# Altium schematic sheet PowerSupply.SchDoc
size B; SheetNumber: 7; SheetTotal: 8
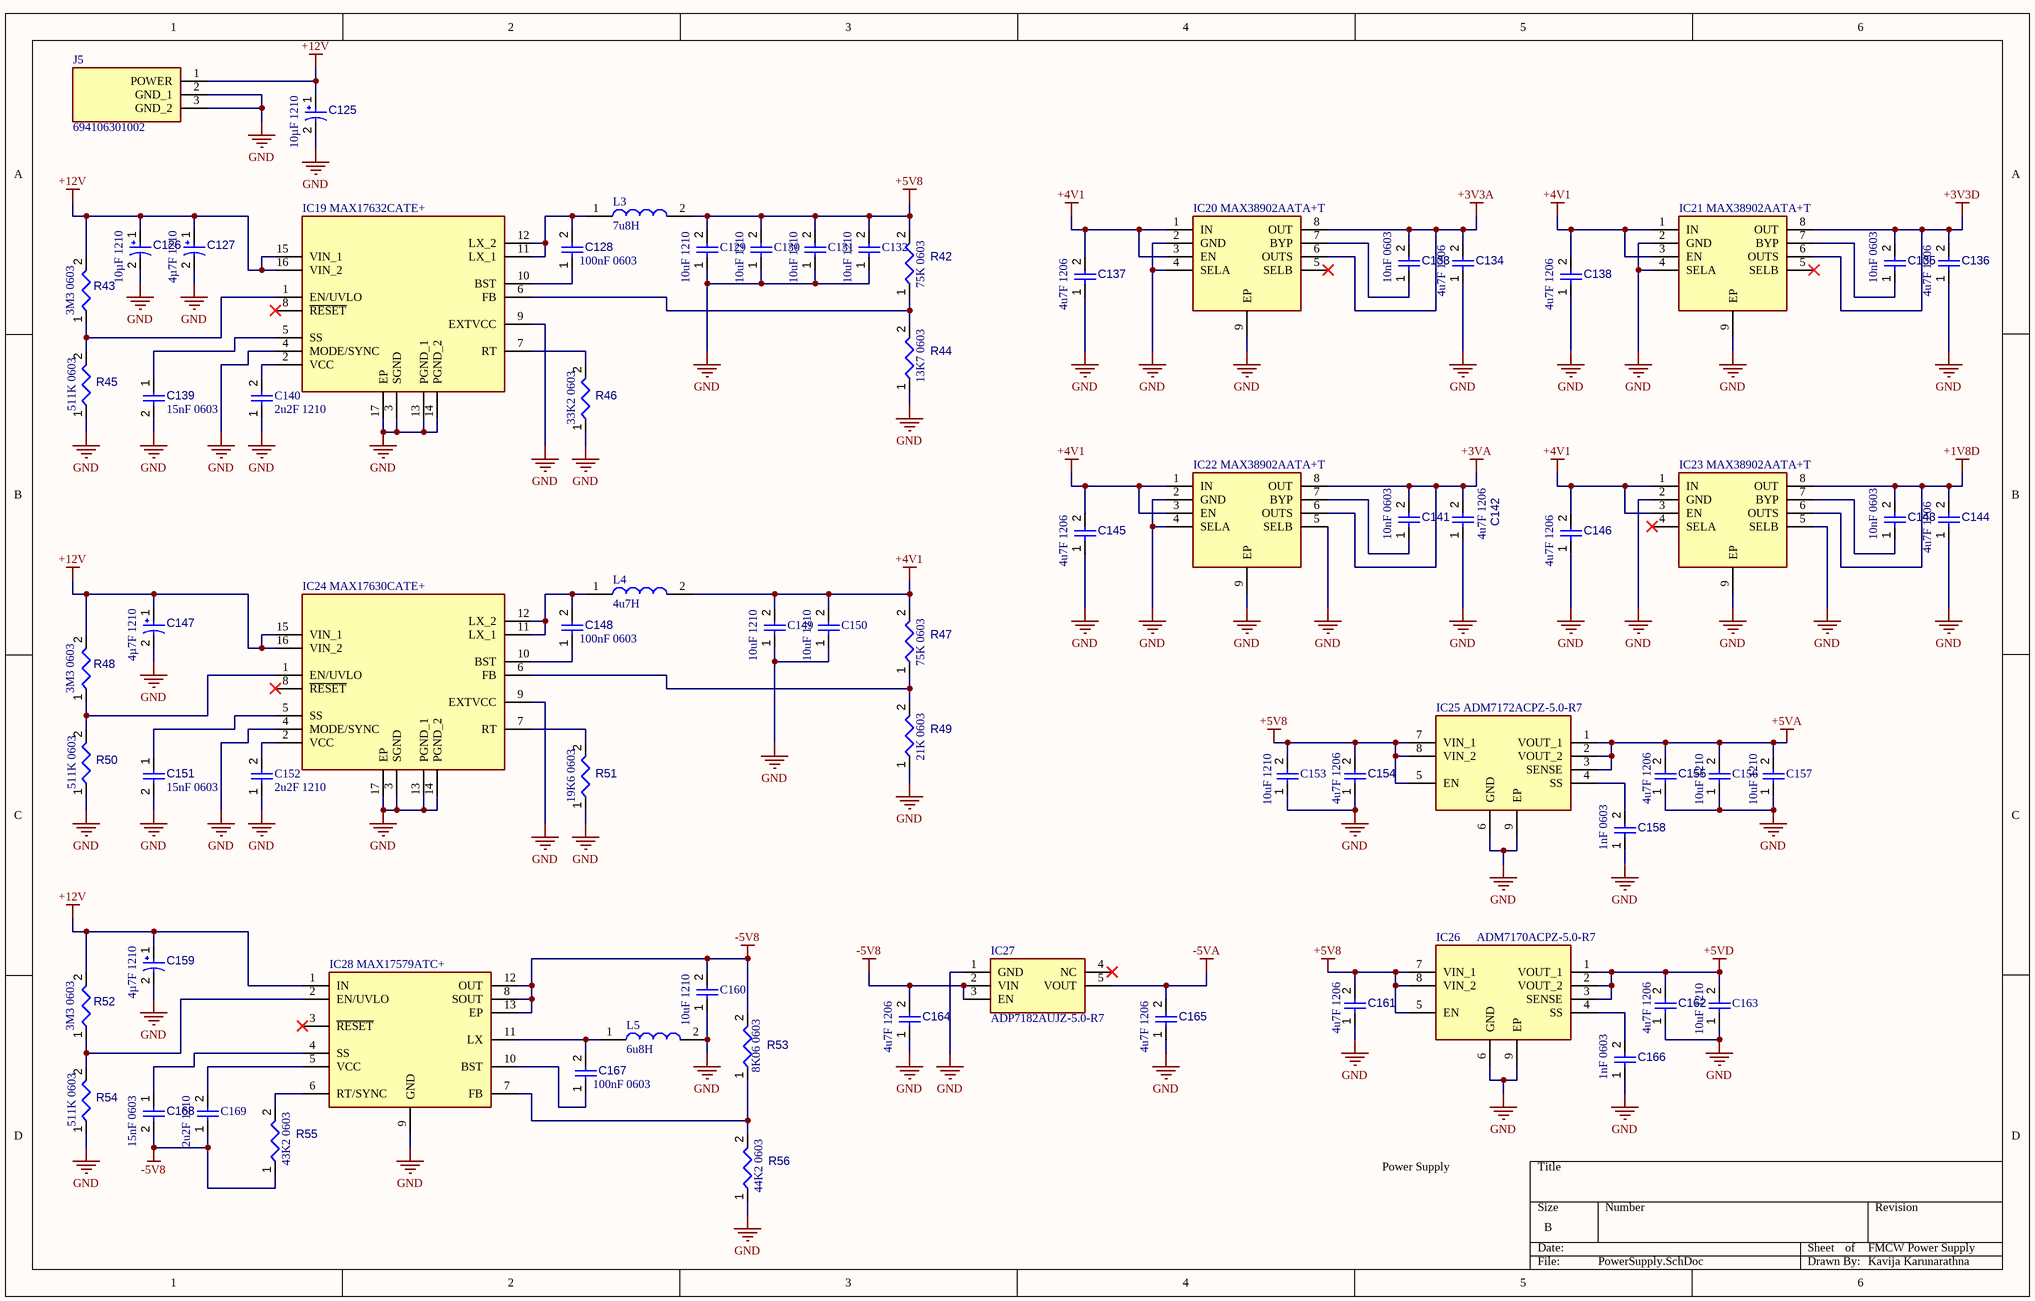
[diagram p0: PowerSupply.SchDoc]

## Parts
C125  value 10µF 1210  [AVX-TAJ-B-2_N]  (hidden comment: TAJB106K016RNJ)
C126  value 10µF 1210  [AVX-TAJ-B-2_N]  (hidden comment: TAJB106K016RNJ)
C127  value 4µ7F 1210  [AVX-TAJ-B-2_N]  (hidden comment: TAJB106K016RNJ)
C128  value 100nF 0603  [CAPC0603(1608)100_L]  (hidden comment: Capacitor 1µF +/-0.1% 25V 0603)
C129  10uF 1210  [CAPC3225X279N]
C130  10uF 1210  [CAPC3225X279N]
C131  10uF 1210  [CAPC3225X279N]
C132  10uF 1210  [CAPC3225X279N]
C133  value 10nF 0603  [CAPC0603(1608)100_L]  (hidden comment: Capacitor 1µF +/-0.1% 25V 0603)
C134  value 4u7F 1206  [CAPC3216X180X50NL20T25]  (hidden comment: Capacitor 10 uF +/- 10% 16 V 1206)
C135  value 10nF 0603  [CAPC0603(1608)100_L]  (hidden comment: Capacitor 1µF +/-0.1% 25V 0603)
C136  value 4u7F 1206  [CAPC3216X180X50NL20T25]  (hidden comment: Capacitor 10 uF +/- 10% 16 V 1206)
C137  value 4u7F 1206  [CAPC3216X180X50NL20T25]  (hidden comment: Capacitor 10 uF +/- 10% 16 V 1206)
C138  value 4u7F 1206  [CAPC3216X180X50NL20T25]  (hidden comment: Capacitor 10 uF +/- 10% 16 V 1206)
C139  value 15nF 0603  [CAPC0603(1608)100_L]  (hidden comment: Capacitor 1µF +/-0.1% 25V 0603)
C140  2u2F 1210  [CAPC3225X279N]
C141  value 10nF 0603  [CAPC0603(1608)100_L]  (hidden comment: Capacitor 1µF +/-0.1% 25V 0603)
C142  value 4u7F 1206  [CAPC3216X180X50NL20T25]  (hidden comment: Capacitor 10 uF +/- 10% 16 V 1206)
C143  value 10nF 0603  [CAPC0603(1608)100_L]  (hidden comment: Capacitor 1µF +/-0.1% 25V 0603)
C144  value 4u7F 1206  [CAPC3216X180X50NL20T25]  (hidden comment: Capacitor 10 uF +/- 10% 16 V 1206)
C145  value 4u7F 1206  [CAPC3216X180X50NL20T25]  (hidden comment: Capacitor 10 uF +/- 10% 16 V 1206)
C146  value 4u7F 1206  [CAPC3216X180X50NL20T25]  (hidden comment: Capacitor 10 uF +/- 10% 16 V 1206)
C147  value 4µ7F 1210  [AVX-TAJ-B-2_N]  (hidden comment: TAJB106K016RNJ)
C148  value 100nF 0603  [CAPC0603(1608)100_L]  (hidden comment: Capacitor 1µF +/-0.1% 25V 0603)
C149  10uF 1210  [CAPC3225X279N]
C150  10uF 1210  [CAPC3225X279N]
C151  value 15nF 0603  [CAPC0603(1608)100_L]  (hidden comment: Capacitor 1µF +/-0.1% 25V 0603)
C152  2u2F 1210  [CAPC3225X279N]
C153  10uF 1210  [CAPC3225X279N]
C154  value 4u7F 1206  [CAPC3216X180X50NL20T25]  (hidden comment: Capacitor 10 uF +/- 10% 16 V 1206)
C155  value 4u7F 1206  [CAPC3216X180X50NL20T25]  (hidden comment: Capacitor 10 uF +/- 10% 16 V 1206)
C156  10uF 1210  [CAPC3225X279N]
C157  10uF 1210  [CAPC3225X279N]
C158  value 1nF 0603  [CAPC0603(1608)100_L]  (hidden comment: Capacitor 1µF +/-0.1% 25V 0603)
C159  value 4µ7F 1210  [AVX-TAJ-B-2_N]  (hidden comment: TAJB106K016RNJ)
C160  10uF 1210  [CAPC3225X279N]
C161  value 4u7F 1206  [CAPC3216X180X50NL20T25]  (hidden comment: Capacitor 10 uF +/- 10% 16 V 1206)
C162  value 4u7F 1206  [CAPC3216X180X50NL20T25]  (hidden comment: Capacitor 10 uF +/- 10% 16 V 1206)
C163  10uF 1210  [CAPC3225X279N]
C164  value 4u7F 1206  [CAPC3216X180X50NL20T25]  (hidden comment: Capacitor 10 uF +/- 10% 16 V 1206)
C165  value 4u7F 1206  [CAPC3216X180X50NL20T25]  (hidden comment: Capacitor 10 uF +/- 10% 16 V 1206)
C166  value 1nF 0603  [CAPC0603(1608)100_L]  (hidden comment: Capacitor 1µF +/-0.1% 25V 0603)
C167  value 100nF 0603  [CAPC0603(1608)100_L]  (hidden comment: Capacitor 1µF +/-0.1% 25V 0603)
C168  value 15nF 0603  [CAPC0603(1608)100_L]  (hidden comment: Capacitor 1µF +/-0.1% 25V 0603)
C169  2u2F 1210  [CAPC3225X279N]
IC19  MAX17632CATE+  [QFN50P300X300X80-17N]
IC20  MAX38902AATA+T  [SON50P200X200X80-9N-D]
IC21  MAX38902AATA+T  [SON50P200X200X80-9N-D]
IC22  MAX38902AATA+T  [SON50P200X200X80-9N-D]
IC23  MAX38902AATA+T  [SON50P200X200X80-9N-D]
IC24  MAX17630CATE+  [QFN50P300X300X80-17N]
IC25  ADM7172ACPZ-5.0-R7  [SON50P300X300X80-9N-D]
IC26  ADM7170ACPZ-5.0-R7  [SON50P300X300X80-9N-D]
IC27  ADP7182AUJZ-5.0-R7  [SOT95P280X100-5N]
IC28  MAX17579ATC+  [SON50P300X300X80-13N]
J5  694106301002  [694106301002]
L3  7u8H  [INDPM135129X640N]
L4  4u7H  [INDPM135129X640N]
L5  6u8H  [SPM7054VC6R8MD]
R42  value 75K 0603  [RESC0603(1608)_L]  (hidden comment: 120R3J)
R43  value 3M3 0603  [RESC0603(1608)_L]  (hidden comment: 120R3J)
R44  value 13K7 0603  [RESC0603(1608)_L]  (hidden comment: 120R3J)
R45  value 511K 0603  [RESC0603(1608)_L]  (hidden comment: 120R3J)
R46  value 33K2 0603  [RESC0603(1608)_L]  (hidden comment: 120R3J)
R47  value 75K 0603  [RESC0603(1608)_L]  (hidden comment: 120R3J)
R48  value 3M3 0603  [RESC0603(1608)_L]  (hidden comment: 120R3J)
R49  value 21K 0603  [RESC0603(1608)_L]  (hidden comment: 120R3J)
R50  value 511K 0603  [RESC0603(1608)_L]  (hidden comment: 120R3J)
R51  value 19K6 0603  [RESC0603(1608)_L]  (hidden comment: 120R3J)
R52  value 3M3 0603  [RESC0603(1608)_L]  (hidden comment: 120R3J)
R53  value 8K06 0603  [RESC0603(1608)_L]  (hidden comment: 120R3J)
R54  value 511K 0603  [RESC0603(1608)_L]  (hidden comment: 120R3J)
R55  value 43K2 0603  [RESC0603(1608)_L]  (hidden comment: 120R3J)
R56  value 44K2 0603  [RESC0603(1608)_L]  (hidden comment: 120R3J)

## Nets
+1V8D: C143.2 C144.2 IC23.6(OUTS) IC23.8(OUT)
+3V3A: C133.2 C134.2 IC20.6(OUTS) IC20.8(OUT)
+3V3D: C135.2 C136.2 IC21.6(OUTS) IC21.8(OUT)
+3VA: C141.2 C142.2 IC22.6(OUTS) IC22.8(OUT)
+4V1: C137.2 C138.2 C145.2 C146.2 C149.2 C150.2 IC20.1(IN) IC20.3(EN) IC21.1(IN) IC21.3(EN) IC22.1(IN) IC22.3(EN) IC23.1(IN) IC23.3(EN) L4.2 R47.2
+5V8: C129.2 C130.2 C131.2 C132.2 C153.2 C154.2 C161.2 IC25.5(EN) IC25.7(VIN_1) IC25.8(VIN_2) IC26.5(EN) IC26.7(VIN_1) IC26.8(VIN_2) L3.2 R42.2
+5VA: C155.2 C156.2 C157.2 IC25.1(VOUT_1) IC25.2(VOUT_2) IC25.3(SENSE)
+5VD: C162.2 C163.2 IC26.1(VOUT_1) IC26.2(VOUT_2) IC26.3(SENSE)
+12V: C125.1 C126.1 C127.1 C147.1 C159.1 IC19.15(VIN_1) IC19.16(VIN_2) IC24.15(VIN_1) IC24.16(VIN_2) IC28.1(IN) J5.1(POWER) R43.2 R48.2 R52.2
-5V8: C160.2 C164.2 C168.2 C169.1 IC27.2(VIN) IC27.3(EN) IC28.8(SOUT) IC28.12(OUT) IC28.13(EP) R53.2 R55.1
-5VA: C165.2 IC27.5(VOUT)
GND: C125.2 C126.2 C127.2 C129.1 C130.1 C131.1 C132.1 C134.1 C136.1 C137.1 C138.1 C139.2 C140.1 C142.1 C144.1 C145.1 C146.1 C147.2 C149.1 C150.1 C151.2 C152.1 C153.1 C154.1 C155.1 C156.1 C157.1 C158.1 C159.2 C160.1 C161.1 C162.1 C163.1 C164.1 C165.1 C166.1 IC19.3(SGND) IC19.4(MODE/SYNC) IC19.9(EXTVCC) IC19.13(PGND_1) IC19.14(PGND_2) IC19.17(EP) IC20.2(GND) IC20.4(SELA) IC20.9(EP) IC21.2(GND) IC21.4(SELA) IC21.9(EP) IC22.2(GND) IC22.4(SELA) IC22.5(SELB) IC22.9(EP) IC23.2(GND) IC23.5(SELB) IC23.9(EP) IC24.3(SGND) IC24.4(MODE/SYNC) IC24.9(EXTVCC) IC24.13(PGND_1) IC24.14(PGND_2) IC24.17(EP) IC25.6(GND) IC25.9(EP) IC26.6(GND) IC26.9(EP) IC27.1(GND) IC28.9(GND) J5.2(GND_1) J5.3(GND_2) L5.2 R44.1 R45.1 R46.1 R49.1 R50.1 R51.1 R54.1 R56.1
NetC128_1: C128.1 IC19.10(BST)
NetC128_2: C128.2 IC19.11(LX_1) IC19.12(LX_2) L3.1
NetC133_1: C133.1 IC20.7(BYP)
NetC135_1: C135.1 IC21.7(BYP)
NetC139_1: C139.1 IC19.5(SS)
NetC140_2: C140.2 IC19.2(VCC)
NetC141_1: C141.1 IC22.7(BYP)
NetC143_1: C143.1 IC23.7(BYP)
NetC148_1: C148.1 IC24.10(BST)
NetC148_2: C148.2 IC24.11(LX_1) IC24.12(LX_2) L4.1
NetC151_1: C151.1 IC24.5(SS)
NetC152_2: C152.2 IC24.2(VCC)
NetC158_2: C158.2 IC25.4(SS)
NetC166_2: C166.2 IC26.4(SS)
NetC167_1: C167.1 IC28.10(BST)
NetC167_2: C167.2 IC28.11(LX) L5.1
NetC168_1: C168.1 IC28.4(SS)
NetC169_2: C169.2 IC28.5(VCC)
NetIC19_1: IC19.1(EN/UVLO) R43.1 R45.2
NetIC19_6: IC19.6(FB) R42.1 R44.2
NetIC19_7: IC19.7(RT) R46.2
NetIC24_1: IC24.1(EN/UVLO) R48.1 R50.2
NetIC24_6: IC24.6(FB) R47.1 R49.2
NetIC24_7: IC24.7(RT) R51.2
NetIC28_2: IC28.2(EN/UVLO) R52.1 R54.2
NetIC28_6: IC28.6(RT/SYNC) R55.2
NetIC28_7: IC28.7(FB) R53.1 R56.2

Not connected (* = marked no-connect by the designer): IC19 8(~{RESET})*; IC20 5(SELB)*; IC21 5(SELB)*; IC23 4(SELA)*; IC24 8(~{RESET})*; IC27 4(NC)*; IC28 3(~{RESET})*

## Notes on the sheet
- Power Supply
- FMCW Power Supply
- Kavija Karunarathna

## Library data of the parts
C125 C126 = CMP-001-00043-7: Tantalum Capacitors - Solid SMD 20V 10uF 10% 1210 ES R = 2.1 Ohm; Manufacturer: AVX; Manufacturer Part No: TAJB106K020SNJ; ESR: 2.8Ohm; Voltage Rating: 16V; RoHS Compliant: True; Capacitor Type: Tantalum; Manufacturer URL: http://www.avx.com/; Pins: 2; Case/Package: 1210; Package Quantity: 2000; Package Description: 2-Pin Surface Mount Device, Body 3.5 x 2.85 mm; Max Operating Temperature: 125°C; Packaging: TapeandReel; Datasheet URL: http://datasheets.avx.com/TAJ.pdf; Tolerance: 10%; Mounting Technology: SM; Datasheet Version: Feb-16; Package Reference: TAJ-B-2; Resistance: 2.8Ohm; Min Operating Temperature: -55°C; Mouser Part No: 581-TAJB106K020SNJ
C127 C147 C159 = CMP-001-00043-7: Tantalum Capacitors - Solid SMD 20V 4.7uF 10% 1210 E SR= 3 Ohm; Manufacturer: AVX; Manufacturer Part No: TAJB475K020RNJ; ESR: 2.8Ohm; Voltage Rating: 16V; RoHS Compliant: True; Capacitor Type: Tantalum; Manufacturer URL: http://www.avx.com/; Pins: 2; Case/Package: 1210; Package Quantity: 2000; Package Description: 2-Pin Surface Mount Device, Body 3.5 x 2.85 mm; Max Operating Temperature: 125°C; Packaging: TapeandReel; Datasheet URL: http://datasheets.avx.com/TAJ.pdf; Tolerance: 10%; Mounting Technology: SM; Datasheet Version: Feb-16; Package Reference: TAJ-B-2; Resistance: 2.8Ohm; Min Operating Temperature: -55°C; Mouser Part No: 581-TAJB475K020
C128 C148 C167 = CMP-001-00055-4: Chip Capacitor, 1µF +/-0.1%, 25V, 0603, Thickness 1 mm; Manufacturer Part No: 0603X104K250CT; Tolerance: 20%; Min Operating Temperature: -55°C; Max Operating Temperature: 85°C; Voltage Rating: 25V; Mounting Technology: SMT; Case/Package: 0603; Pins: 2; Mouser Part No: 791-0603X104K250CT
C129-C132 C149 C150 C153 C156 C157 C160 C163 = 12105C475K4Z2A: Multilayer Ceramic Capacitors MLCC - SMD/SMT 100V 2.2uF X7R 1210 5% AEC-Q200; Manufacturer_Name: Kyocera AVX; Manufacturer Part No: C1210C106K6PACTU; Mouser Part No: 80-C1210C106K6P; Mouser Price/Stock: https://www.mouser.co.uk/ProductDetail/KYOCERA-AVX/12105C475K4Z2A?qs=1X9trZCrWl1tMuskY%2F55Eg%3D%3D; Arrow Part Number: 12105C475K4Z2A; Arrow Price/Stock: https://www.arrow.com/en/products/12105c475k4z2a/avx.html?utm_currency=USD&region=nac
C133 C135 C141 C143 = CMP-001-00055-4: Multilayer Ceramic Capacitors MLCC - SMD/SMT 0603 10nF 16volts X7R 10%; Manufacturer Part No: VJ0603Y103KXJAC31X; Tolerance: 20%; Min Operating Temperature: -55°C; Max Operating Temperature: 85°C; Voltage Rating: 25V; Mounting Technology: SMT; Case/Package: 0603; Pins: 2; Mouser Part No: 77-V0603Y103KXJAC31X
C134 C136-C138 C142 C144-C146 C154 C155 C161 C162 C164 C165 = CMP-001-00016-6: Chip Capacitor, 10 uF, +/- 10%, 16 V, 1206 (3216 Metric); Manufacturer Part No: CC1206KFX7R9BB475; Capacitor Type: Ceramic; Voltage Rating: 16V; Tolerance: 10%; Min Operating Temperature: -55°C; Pins: 2; Mounting Technology: SM; Case/Package: 1206; Max Operating Temperature: 125°C; RoHS Compliant: True; Mouser Part No: 603-CC1206KFX7R9B475
C139 C151 C168 = CMP-001-00055-4: Chip Capacitor, 1µF +/-0.1%, 25V, 0603, Thickness 1 mm; Manufacturer Part No: VJ0603Y153KXJAC31X; Tolerance: 20%; Min Operating Temperature: -55°C; Max Operating Temperature: 85°C; Voltage Rating: 25V; Mounting Technology: SMT; Case/Package: 0603; Pins: 2; Mouser Part No: 77-V0603Y153KXJAC31X
C140 C152 C169 = 12105C475K4Z2A: Multilayer Ceramic Capacitors MLCC - SMD/SMT 100V 2.2uF X7R 1210 5% AEC-Q200; Manufacturer_Name: Kyocera AVX; Manufacturer Part No: C1210C225J1RACAUTO; Mouser Part No: 80-C1210C225J1RAUTO; Mouser Price/Stock: https://www.mouser.co.uk/ProductDetail/KYOCERA-AVX/12105C475K4Z2A?qs=1X9trZCrWl1tMuskY%2F55Eg%3D%3D; Arrow Part Number: 12105C475K4Z2A; Arrow Price/Stock: https://www.arrow.com/en/products/12105c475k4z2a/avx.html?utm_currency=USD&region=nac
C158 C166 = CMP-001-00055-4: Multilayer Ceramic Capacitors MLCC - SMD/SMT 0603 10nF 16volts X7R 10%; Manufacturer Part No: 06035C102J4T4A; Tolerance: 20%; Min Operating Temperature: -55°C; Max Operating Temperature: 85°C; Voltage Rating: 25V; Mounting Technology: SMT; Case/Package: 0603; Pins: 2; Mouser Part No: 581-06035C102J4T4A
IC19 = MAX17632CATE+: Integrated Circuit; Manufacturer_Name: Analog Devices; Datasheet Link: https://www.analog.com/media/en/technical-documentation/data-sheets/MAX17632.pdf; Height: 0.8mm; Manufacturer Part No: MAX17632CATE+; Mouser Part No: 700-MAX17632CATE+; Mouser Price/Stock: https://www.mouser.co.uk/ProductDetail/Analog-Devices-Maxim-Integrated/MAX17632CATE%2b?qs=rrS6PyfT74fyPnhYKRDMtg%3D%3D; Arrow Part Number: MAX17632CATE+; Arrow Price/Stock: https://www.arrow.com/en/products/max17632cate/analog-devices?utm_currency=USD&region=nac
IC20-IC23 = MAX38902AATA+T: Integrated Circuit; Manufacturer_Name: Analog Devices; Datasheet Link: https://www.analog.com/MAX38902A/datasheet; Height: 0.8mm; Manufacturer Part No: MAX38902AATA+T; Mouser Part No: 700-MAX38902AATA+T; Mouser Price/Stock: https://www.mouser.co.uk/ProductDetail/Analog-Devices-Maxim-Integrated/MAX38902AATA%2bT?qs=rrS6PyfT74ceu65lHXtPmw%3D%3D; Arrow Part Number: MAX38902AATA+T; Arrow Price/Stock: https://www.arrow.com/en/products/max38902aatat/analog-devices?utm_currency=USD&region=nac
IC24 = MAX17630CATE+: Switching Voltage Regulators For MAX17631C: 4.5V to 36V, 1.5A, High-E; Manufacturer_Name: Analog Devices; Datasheet Link: https://pdfserv.maximintegrated.com/package_dwgs/21-0136.PDF; Height: 0.8mm; Manufacturer Part No: MAX17630CATE+; Mouser Part No: 700-MAX17630CATE+; Mouser Price/Stock: https://www.mouser.co.uk/ProductDetail/Analog-Devices-Maxim-Integrated/MAX17630CATE%2b?qs=XeJtXLiO41TinQPE%252B2CXug%3D%3D
IC25 = ADM7172ACPZ-5.0-R7: Integrated Circuit; Manufacturer_Name: Analog Devices; Datasheet Link: https://componentsearchengine.com/Datasheets/2/ADM7172ACPZ-5.0-R7.pdf; Height: 0.8mm; Manufacturer Part No: ADM7172ACPZ-5.0-R7; Mouser Part No: 584-ADM7172ACPZ5.0R7; Mouser Price/Stock: https://www.mouser.co.uk/ProductDetail/Analog-Devices/ADM7172ACPZ-5.0-R7?qs=iCT64eccu7gCprD3ZRgcTA%3D%3D; Arrow Part Number: ADM7172ACPZ-5.0-R7; Arrow Price/Stock: https://www.arrow.com/en/products/adm7172acpz-5.0-r7/analog-devices?utm_currency=USD&region=nac
IC26 = ADM7170ACPZ-5.0-R7: Integrated Circuit; Manufacturer_Name: Analog Devices; Datasheet Link: https://www.mouser.com/datasheet/2/609/ADM7170-1503220.pdf; Height: 0.8mm; Manufacturer Part No: ADM7170ACPZ-5.0-R7; Mouser Part No: 584-ADM7170ACPZ5.0R7; Mouser Price/Stock: https://www.mouser.co.uk/ProductDetail/Analog-Devices/ADM7170ACPZ-5.0-R7?qs=iCT64eccu7gt2itXdfapaA%3D%3D; Arrow Part Number: ADM7170ACPZ-5.0-R7; Arrow Price/Stock: https://www.arrow.com/en/products/adm7170acpz-5.0-r7/analog-devices.html?utm_currency=USD&region=nac
IC27 = ADP7182AUJZ-5.0-R7: Integrated Circuit; Manufacturer_Name: Analog Devices; Datasheet Link: https://www.analog.com/media/en/technical-documentation/data-sheets/ADP7182.pdf; Height: 1mm; Manufacturer Part No: ADP7182AUJZ-5.0-R7; Mouser Part No: 584-ADP7182AUJZ5.0R7; Mouser Price/Stock: https://www.mouser.co.uk/ProductDetail/Analog-Devices/ADP7182AUJZ-5.0-R7?qs=J50fqX%2Fl9ioiLvDNRlnZkg%3D%3D; Arrow Part Number: ADP7182AUJZ-5.0-R7; Arrow Price/Stock: https://www.arrow.com/en/products/adp7182aujz-5.0-r7/analog-devices.html?utm_currency=USD&region=nac
IC28 = MAX17579ATC+: Integrated Circuit; Manufacturer_Name: Analog Devices; Datasheet Link: https://datasheets.maximintegrated.com/en/ds/MAX17579-MAX17580.pdf; Height: 0.8mm; Manufacturer Part No: MAX17579ATC+; Mouser Part No: 700-MAX17579ATC+; Mouser Price/Stock: https://www.mouser.co.uk/ProductDetail/Analog-Devices-Maxim-Integrated/MAX17579ATC%2b?qs=TuK3vfAjtkVNUN7nmSqbCQ%3D%3D; Arrow Part Number: MAX17579ATC+; Arrow Price/Stock: null?utm_currency=USD&region=nac
J5 = 694106301002: Connector; Manufacturer_Name: Wurth Elektronik; Datasheet Link: https://www.we-online.com/catalog/datasheet/694106301002.pdf; Height: 11mm; Manufacturer Part No: 694106301002; Mouser Part No: 710-694106301002; Mouser Price/Stock: https://www.mouser.co.uk/ProductDetail/Wurth-Elektronik/694106301002?qs=a9WhcLg8qCwOEkcI62k5mA%3D%3D
L3 = IHLP5050FDER7R8M5A: Inductor; Manufacturer_Name: Vishay; Datasheet Link: https://www.vishay.com/docs/34337/ihlp-5050fd-5a.pdf; Height: 6.4mm; Manufacturer Part No: IHLP5050FDER7R8M5A; Mouser Part No: 70-IHLP5050FDR7R8M5A; Mouser Price/Stock: https://www.mouser.co.uk/ProductDetail/Vishay-Dale/IHLP5050FDER7R8M5A?qs=tDDpbAIEejqcE088n9SrNw%3D%3D
L4 = IHLP5050FDER4R7M5A: Inductor; Manufacturer_Name: Vishay; Datasheet Link: https://www.arrow.com/en/products/ihlp5050fder4r7m5a/vishay?region=nac; Height: 6.4mm; Manufacturer Part No: IHLP5050FDER4R7M5A; Mouser Part No: 70-IHLP5050FDR4R7M5A; Mouser Price/Stock: https://www.mouser.co.uk/ProductDetail/Vishay-Dale/IHLP5050FDER4R7M5A?qs=tDDpbAIEejrTl7lwUHZ91g%3D%3D; Arrow Part Number: IHLP5050FDER4R7M5A; Arrow Price/Stock: https://www.arrow.com/en/products/ihlp5050fder4r7m5a/vishay?region=nac
L5 = SPM7054VC-6R8M-D: Inductor; Manufacturer_Name: TDK; Datasheet Link: https://product.tdk.com/system/files/dam/doc/product/inductor/inductor/smd/catalog/inductor_automotive_power_spm7054vc-d_en.pdf; Height: 5.4mm; Manufacturer Part No: SPM7054VC-6R8M-D; Mouser Part No: 810-SPM7054VC-6R8M-D; Mouser Price/Stock: https://www.mouser.co.uk/ProductDetail/TDK/SPM7054VC-6R8M-D?qs=t7xnP681wgUOSFNjNlUlgg%3D%3D
R42 R47 = CMP-009-00069-2: Thick Film Resistors - SMD General Purpose Chip Resistor 0603, 200Ohms, 1%, 1/10W; Manufacturer Part No: CR0603-FX-7502ELF; Power: 100mW; Tolerance: 5%; Mounting Technology: SMT; Case/Package: 0603; Pins: 2; Mouser Part No: 652-CR0603FX-7502ELF
R43 R48 R52 = CMP-009-00069-2: Thick Film Resistors - SMD 3.3 MOhms 100 mW (1/10 W) 0603 1 % AEC-Q200; Manufacturer Part No: AF0603FR-073M3L; Power: 100mW; Tolerance: 5%; Mounting Technology: SMT; Case/Package: 0603; Pins: 2; Mouser Part No: 603-AF0603FR-073M3L
R44 = CMP-009-00069-2: Thick Film Resistors - SMD General Purpose Chip Resistor 0603, 200Ohms, 1%, 1/10W; Manufacturer Part No: RT0603BRE0713K7L; Power: 100mW; Tolerance: 5%; Mounting Technology: SMT; Case/Package: 0603; Pins: 2; Mouser Part No: 603-RT0603BRE0713K7L
R45 R50 R54 = CMP-009-00069-2: Thick Film Resistors - SMD General Purpose Chip Resistor 0603, 200Ohms, 1%, 1/10W; Manufacturer Part No: CRCW0603511KFKEAC; Power: 100mW; Tolerance: 5%; Mounting Technology: SMT; Case/Package: 0603; Pins: 2; Mouser Part No: 71-CRCW0603511KFKEAC
R46 = CMP-009-00069-2: Thick Film Resistors - SMD General Purpose Chip Resistor 0603, 200Ohms, 1%, 1/10W; Manufacturer Part No: AF0603FR-0733K2L; Power: 100mW; Tolerance: 5%; Mounting Technology: SMT; Case/Package: 0603; Pins: 2; Mouser Part No: 603-AF0603FR-0733K2L
R49 = CMP-009-00069-2: Thick Film Resistors - SMD General Purpose Chip Resistor 0603, 200Ohms, 1%, 1/10W; Manufacturer Part No: CR0603-FX-2102ELF; Power: 100mW; Tolerance: 5%; Mounting Technology: SMT; Case/Package: 0603; Pins: 2; Mouser Part No: 652-CR0603FX-2102ELF
R51 = CMP-009-00069-2: Thick Film Resistors - SMD General Purpose Chip Resistor 0603, 200Ohms, 1%, 1/10W; Manufacturer Part No: RT0603DRE0719K6L; Power: 100mW; Tolerance: 5%; Mounting Technology: SMT; Case/Package: 0603; Pins: 2; Mouser Part No: 603-RT0603DRE0719K6L
R53 = CMP-009-00069-2: Thin Film Resistors - SMD RN 0603 8K06 0.1% 10PPM; Manufacturer Part No: RN73C1J8K06BTDF; Power: 100mW; Tolerance: 5%; Mounting Technology: SMT; Case/Package: 0603; Pins: 2; Mouser Part No: 279-RN73C1J8K06BTDF
R55 = CMP-009-00069-2: Thick Film Resistors - SMD General Purpose Chip Resistor 0603, 200Ohms, 1%, 1/10W; Manufacturer Part No: RT0603DRE0743K2L; Power: 100mW; Tolerance: 5%; Mounting Technology: SMT; Case/Package: 0603; Pins: 2; Mouser Part No: 603-RT0603DRE0743K2L
R56 = CMP-009-00069-2: Thick Film Resistors - SMD General Purpose Chip Resistor 0603, 200Ohms, 1%, 1/10W; Manufacturer Part No: CRCW060344K2FKTA; Power: 100mW; Tolerance: 5%; Mounting Technology: SMT; Case/Package: 0603; Pins: 2; Mouser Part No: 71-CRCW0603-44.2K